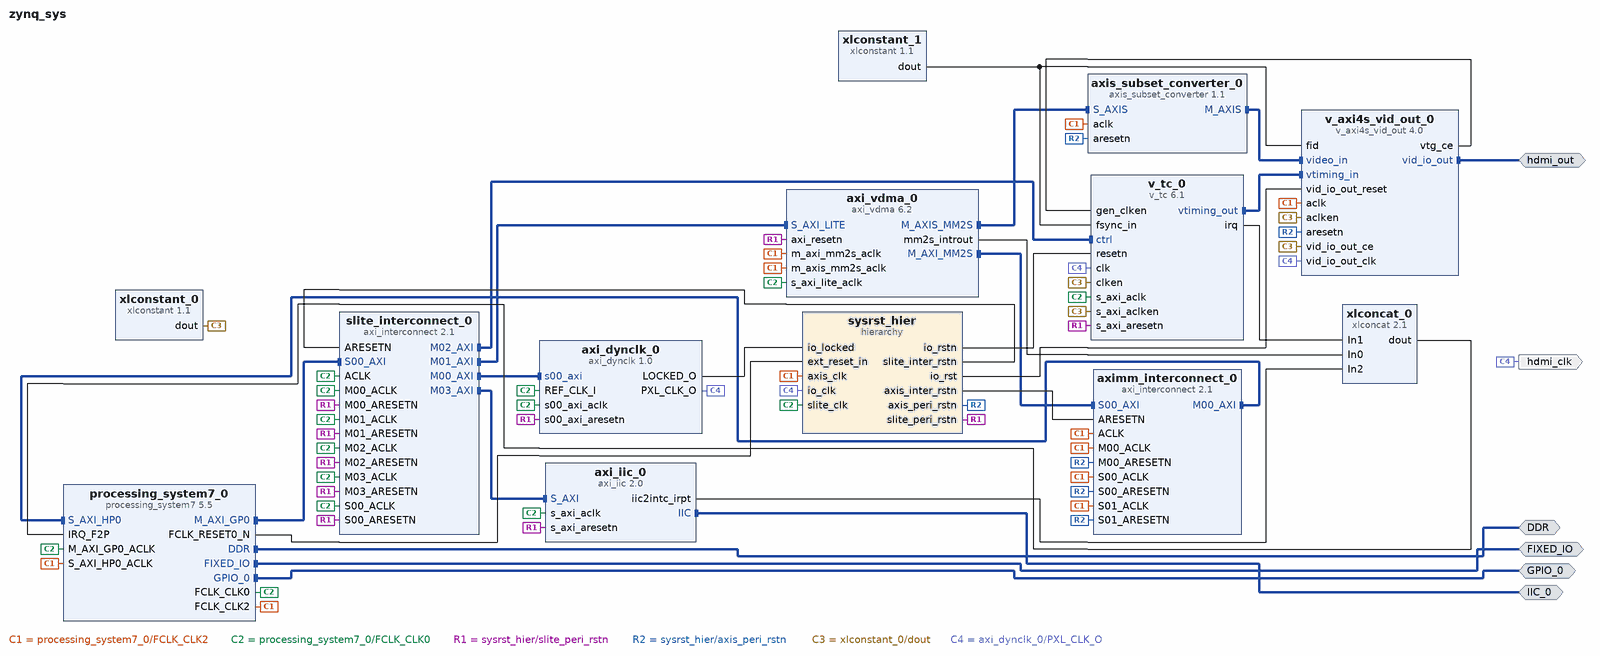
[diagram p0: block diagram of the top level]
# Vivado block design zynq_sys, Vivado 2015.4
create_bd_design zynq_sys

create_bd_intf_port -mode Master -vlnv xilinx.com:interface:vid_io_rtl:1.0 hdmi_out
create_bd_intf_port -mode Master -vlnv xilinx.com:interface:ddrx_rtl:1.0 DDR
create_bd_intf_port -mode Master -vlnv xilinx.com:display_processing_system7:fixedio_rtl:1.0 FIXED_IO
create_bd_intf_port -mode Master -vlnv xilinx.com:interface:gpio_rtl:1.0 GPIO_0
create_bd_intf_port -mode Master -vlnv xilinx.com:interface:iic_rtl:1.0 IIC_0
create_bd_port -dir O -type clk hdmi_clk

create_bd_cell -type ip -vlnv xilinx.com:ip:processing_system7:5.5 processing_system7_0
set_property -dict [list \
  CONFIG.PCW_FPGA0_PERIPHERAL_FREQMHZ 100 \
  CONFIG.PCW_FPGA1_PERIPHERAL_FREQMHZ 200 \
  CONFIG.PCW_FPGA2_PERIPHERAL_FREQMHZ 150 \
  CONFIG.PCW_USE_S_AXI_HP0 1 \
  CONFIG.PCW_USE_FABRIC_INTERRUPT 1 \
  CONFIG.PCW_EN_CLK1_PORT 1 \
  CONFIG.PCW_EN_CLK2_PORT 1 \
  CONFIG.PCW_IRQ_F2P_INTR 1 \
  CONFIG.PCW_PRESET_BANK1_VOLTAGE {LVCMOS 1.8V} \
  CONFIG.PCW_UIPARAM_DDR_PARTNO {MT41J256M16 RE-125} \
  CONFIG.PCW_QSPI_PERIPHERAL_ENABLE 1 \
  CONFIG.PCW_QSPI_QSPI_IO {MIO 1 .. 6} \
  CONFIG.PCW_QSPI_GRP_SINGLE_SS_ENABLE 1 \
  CONFIG.PCW_ENET0_PERIPHERAL_ENABLE 1 \
  CONFIG.PCW_ENET0_ENET0_IO {MIO 16 .. 27} \
  CONFIG.PCW_ENET0_GRP_MDIO_ENABLE 1 \
  CONFIG.PCW_ENET0_RESET_ENABLE 1 \
  CONFIG.PCW_ENET0_RESET_IO {MIO 51} \
  CONFIG.PCW_SD0_PERIPHERAL_ENABLE 1 \
  CONFIG.PCW_SD0_SD0_IO {MIO 40 .. 45} \
  CONFIG.PCW_UART0_PERIPHERAL_ENABLE 1 \
  CONFIG.PCW_UART0_UART0_IO {MIO 10 .. 11} \
  CONFIG.PCW_UART1_PERIPHERAL_ENABLE 1 \
  CONFIG.PCW_CAN0_PERIPHERAL_ENABLE 1 \
  CONFIG.PCW_CAN0_CAN0_IO {MIO 14 .. 15} \
  CONFIG.PCW_TTC0_PERIPHERAL_ENABLE 1 \
  CONFIG.PCW_USB0_PERIPHERAL_ENABLE 1 \
  CONFIG.PCW_USB0_RESET_ENABLE 0 \
  CONFIG.PCW_I2C1_PERIPHERAL_ENABLE 1 \
  CONFIG.PCW_I2C1_I2C1_IO {MIO 12 .. 13} \
  CONFIG.PCW_GPIO_MIO_GPIO_ENABLE 1 \
  CONFIG.PCW_GPIO_EMIO_GPIO_ENABLE 1 \
  CONFIG.PCW_FCLK2_PERIPHERAL_CLKSRC {ARM PLL} \
] [get_bd_cells processing_system7_0]
# 14 more settings of processing_system7_0 are not shown: defaults, MIO pin electricals, DDR timing, and values the tool derives
create_bd_cell -type ip -vlnv xilinx.com:ip:axi_vdma:6.2 axi_vdma_0
set_property -dict [list \
  CONFIG.c_num_fstores 1 \
  CONFIG.c_use_mm2s_fsync 0 \
  CONFIG.c_mm2s_genlock_mode 0 \
  CONFIG.c_include_s2mm 0 \
] [get_bd_cells axi_vdma_0]
create_bd_cell -type ip -vlnv xilinx.com:ip:v_axi4s_vid_out:4.0 v_axi4s_vid_out_0
set_property -dict {CONFIG.C_HAS_ASYNC_CLK 1 CONFIG.C_VTG_MASTER_SLAVE 1} [get_bd_cells v_axi4s_vid_out_0]
create_bd_cell -type ip -vlnv xilinx.com:ip:v_tc:6.1 v_tc_0
set_property -dict {CONFIG.VIDEO_MODE 1080p CONFIG.enable_detection false} [get_bd_cells v_tc_0]
create_bd_cell -type ip -vlnv xilinx.com:ip:axi_interconnect:2.1 slite_interconnect_0
set_property -dict {CONFIG.NUM_MI 4 CONFIG.STRATEGY 1} [get_bd_cells slite_interconnect_0]
create_bd_cell -type ip -vlnv xilinx.com:ip:axi_interconnect:2.1 aximm_interconnect_0
set_property -dict [list \
  CONFIG.NUM_SI 2 \
  CONFIG.NUM_MI 1 \
  CONFIG.STRATEGY 0 \
  CONFIG.ENABLE_ADVANCED_OPTIONS 0 \
  CONFIG.S00_HAS_DATA_FIFO 2 \
] [get_bd_cells aximm_interconnect_0]
create_bd_cell -type ip -vlnv xilinx.com:ip:xlconstant:1.1 xlconstant_0
create_bd_cell -type ip -vlnv xilinx.com:ip:axis_subset_converter:1.1 axis_subset_converter_0
set_property -dict [list \
  CONFIG.S_TDATA_NUM_BYTES 4 \
  CONFIG.M_TDATA_NUM_BYTES 2 \
  CONFIG.TDATA_REMAP {tdata[23:19],tdata[15:10],tdata[7:3]} \
  CONFIG.TUSER_REMAP {tuser[0:0]} \
  CONFIG.TKEEP_REMAP {tkeep[1:0]} \
] [get_bd_cells axis_subset_converter_0]
create_bd_cell -type hier sysrst_hier
create_bd_cell -type ip -vlnv xilinx.com:ip:xlconcat:2.1 xlconcat_0
set_property -dict {CONFIG.NUM_PORTS 3} [get_bd_cells xlconcat_0]
create_bd_cell -type ip -vlnv xilinx.com:ip:axi_iic:2.0 axi_iic_0
create_bd_cell -type ip -vlnv digilentinc.com:ip:axi_dynclk:1.0 axi_dynclk_0
create_bd_cell -type ip -vlnv xilinx.com:ip:xlconstant:1.1 xlconstant_1
set_property -dict {CONFIG.CONST_VAL 0} [get_bd_cells xlconstant_1]

# ---- hierarchy /sysrst_hier ----
current_bd_instance /sysrst_hier
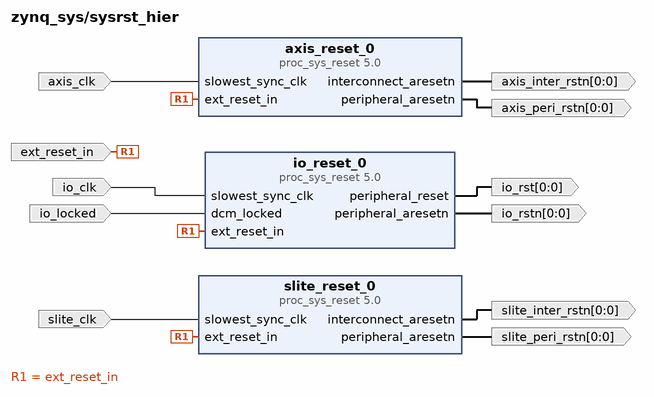
[diagram p1: block diagram inside /sysrst_hier]
create_bd_pin -dir I -type clk slite_clk
create_bd_pin -dir I -type rst ext_reset_in
create_bd_pin -dir O -from 0 -to 0 -type rst slite_inter_rstn
create_bd_pin -dir O -from 0 -to 0 -type rst slite_peri_rstn
create_bd_pin -dir I -type clk axis_clk
create_bd_pin -dir O -from 0 -to 0 -type rst axis_inter_rstn
create_bd_pin -dir O -from 0 -to 0 -type rst axis_peri_rstn
create_bd_pin -dir I -type clk io_clk
create_bd_pin -dir O -from 0 -to 0 -type rst io_rst
create_bd_pin -dir O -from 0 -to 0 -type rst io_rstn
create_bd_pin -dir I io_locked

create_bd_cell -type ip -vlnv xilinx.com:ip:proc_sys_reset:5.0 slite_reset_0
create_bd_cell -type ip -vlnv xilinx.com:ip:proc_sys_reset:5.0 axis_reset_0
create_bd_cell -type ip -vlnv xilinx.com:ip:proc_sys_reset:5.0 io_reset_0

# ---- connections ----

current_bd_instance /sysrst_hier
connect_bd_net -net processing_system7_0_FCLK_CLK0 [get_bd_pins slite_clk] [get_bd_pins slite_reset_0/slowest_sync_clk]
connect_bd_net -net processing_system7_0_FCLK_RESET0_N [get_bd_pins ext_reset_in] \
  [get_bd_pins axis_reset_0/ext_reset_in] [get_bd_pins slite_reset_0/ext_reset_in] [get_bd_pins io_reset_0/ext_reset_in]
connect_bd_net [get_bd_pins slite_reset_0/interconnect_aresetn] [get_bd_pins slite_inter_rstn]
connect_bd_net [get_bd_pins slite_reset_0/peripheral_aresetn] [get_bd_pins slite_peri_rstn]
connect_bd_net -net axi_clkgen_0_clk_0 [get_bd_pins axis_clk] [get_bd_pins axis_reset_0/slowest_sync_clk]
connect_bd_net [get_bd_pins axis_reset_0/interconnect_aresetn] [get_bd_pins axis_inter_rstn]
connect_bd_net [get_bd_pins axis_reset_0/peripheral_aresetn] [get_bd_pins axis_peri_rstn]
connect_bd_net -net slowest_sync_clk_1 [get_bd_pins io_clk] [get_bd_pins io_reset_0/slowest_sync_clk]
connect_bd_net [get_bd_pins io_reset_0/peripheral_reset] [get_bd_pins io_rst]
connect_bd_net [get_bd_pins io_reset_0/peripheral_aresetn] [get_bd_pins io_rstn]
connect_bd_net [get_bd_pins io_locked] [get_bd_pins io_reset_0/dcm_locked]

current_bd_instance /
connect_bd_intf_net [get_bd_intf_pins v_tc_0/vtiming_out] [get_bd_intf_pins v_axi4s_vid_out_0/vtiming_in]
connect_bd_intf_net [get_bd_intf_pins processing_system7_0/M_AXI_GP0] [get_bd_intf_pins slite_interconnect_0/S00_AXI]
connect_bd_intf_net -intf_net axi_interconnect_0_M01_AXI [get_bd_intf_pins slite_interconnect_0/M01_AXI] [get_bd_intf_pins axi_vdma_0/S_AXI_LITE]
connect_bd_intf_net [get_bd_intf_pins axi_vdma_0/M_AXI_MM2S] [get_bd_intf_pins aximm_interconnect_0/S00_AXI]
connect_bd_intf_net [get_bd_intf_pins aximm_interconnect_0/M00_AXI] [get_bd_intf_pins processing_system7_0/S_AXI_HP0]
connect_bd_intf_net [get_bd_intf_pins axis_subset_converter_0/S_AXIS] [get_bd_intf_pins axi_vdma_0/M_AXIS_MM2S]
connect_bd_intf_net [get_bd_intf_pins axi_dynclk_0/s00_axi] [get_bd_intf_pins slite_interconnect_0/M00_AXI]
connect_bd_intf_net [get_bd_intf_pins axis_subset_converter_0/M_AXIS] [get_bd_intf_pins v_axi4s_vid_out_0/video_in]
connect_bd_intf_net [get_bd_intf_pins v_tc_0/ctrl] [get_bd_intf_pins slite_interconnect_0/M02_AXI]
connect_bd_intf_net [get_bd_intf_pins axi_iic_0/S_AXI] [get_bd_intf_pins slite_interconnect_0/M03_AXI]
connect_bd_intf_net [get_bd_intf_ports hdmi_out] [get_bd_intf_pins v_axi4s_vid_out_0/vid_io_out]
connect_bd_intf_net [get_bd_intf_ports DDR] [get_bd_intf_pins processing_system7_0/DDR]
connect_bd_intf_net [get_bd_intf_ports FIXED_IO] [get_bd_intf_pins processing_system7_0/FIXED_IO]
connect_bd_intf_net [get_bd_intf_ports GPIO_0] [get_bd_intf_pins processing_system7_0/GPIO_0]
connect_bd_intf_net [get_bd_intf_ports IIC_0] [get_bd_intf_pins axi_iic_0/IIC]
connect_bd_net -net axi_clkgen_0_clk_0 [get_bd_pins processing_system7_0/FCLK_CLK2] \
  [get_bd_pins axi_vdma_0/m_axis_mm2s_aclk] [get_bd_pins processing_system7_0/S_AXI_HP0_ACLK] \
  [get_bd_pins axi_vdma_0/m_axi_mm2s_aclk] [get_bd_pins axis_subset_converter_0/aclk] [get_bd_pins v_axi4s_vid_out_0/aclk] \
  [get_bd_pins aximm_interconnect_0/ACLK] [get_bd_pins aximm_interconnect_0/S00_ACLK] \
  [get_bd_pins aximm_interconnect_0/M00_ACLK] [get_bd_pins sysrst_hier/axis_clk] [get_bd_pins aximm_interconnect_0/S01_ACLK]
connect_bd_net [get_bd_pins processing_system7_0/FCLK_CLK0] \
  [get_bd_pins axi_vdma_0/s_axi_lite_aclk] [get_bd_pins processing_system7_0/M_AXI_GP0_ACLK] [get_bd_pins v_tc_0/s_axi_aclk] \
  [get_bd_pins axi_iic_0/s_axi_aclk] [get_bd_pins axi_dynclk_0/s00_axi_aclk] [get_bd_pins axi_dynclk_0/REF_CLK_I] \
  [get_bd_pins slite_interconnect_0/M01_ACLK] [get_bd_pins slite_interconnect_0/ACLK] \
  [get_bd_pins slite_interconnect_0/S00_ACLK] [get_bd_pins slite_interconnect_0/M00_ACLK] \
  [get_bd_pins slite_interconnect_0/M02_ACLK] [get_bd_pins slite_interconnect_0/M03_ACLK] [get_bd_pins sysrst_hier/slite_clk]
connect_bd_net [get_bd_pins processing_system7_0/FCLK_RESET0_N] [get_bd_pins sysrst_hier/ext_reset_in]
connect_bd_net -net slite_reset_0_interconnect_aresetn [get_bd_pins sysrst_hier/slite_inter_rstn] [get_bd_pins slite_interconnect_0/ARESETN]
connect_bd_net -net slite_reset_0_peripheral_aresetn [get_bd_pins sysrst_hier/slite_peri_rstn] \
  [get_bd_pins v_tc_0/s_axi_aresetn] [get_bd_pins axi_vdma_0/axi_resetn] [get_bd_pins axi_iic_0/s_axi_aresetn] \
  [get_bd_pins axi_dynclk_0/s00_axi_aresetn] [get_bd_pins slite_interconnect_0/S00_ARESETN] \
  [get_bd_pins slite_interconnect_0/M00_ARESETN] [get_bd_pins slite_interconnect_0/M01_ARESETN] \
  [get_bd_pins slite_interconnect_0/M02_ARESETN] [get_bd_pins slite_interconnect_0/M03_ARESETN]
connect_bd_net -net axis_reset_0_interconnect_aresetn [get_bd_pins sysrst_hier/axis_inter_rstn] [get_bd_pins aximm_interconnect_0/ARESETN]
connect_bd_net -net axis_reset_0_peripheral_aresetn [get_bd_pins sysrst_hier/axis_peri_rstn] \
  [get_bd_pins axis_subset_converter_0/aresetn] [get_bd_pins v_axi4s_vid_out_0/aresetn] \
  [get_bd_pins aximm_interconnect_0/S00_ARESETN] [get_bd_pins aximm_interconnect_0/M00_ARESETN] \
  [get_bd_pins aximm_interconnect_0/S01_ARESETN]
connect_bd_net [get_bd_pins xlconstant_0/dout] \
  [get_bd_pins v_axi4s_vid_out_0/aclken] [get_bd_pins v_axi4s_vid_out_0/vid_io_out_ce] [get_bd_pins v_tc_0/clken] \
  [get_bd_pins v_tc_0/s_axi_aclken]
connect_bd_net [get_bd_pins xlconcat_0/dout] [get_bd_pins processing_system7_0/IRQ_F2P]
connect_bd_net [get_bd_pins axi_vdma_0/mm2s_introut] [get_bd_pins xlconcat_0/In0]
connect_bd_net [get_bd_pins v_tc_0/irq] [get_bd_pins xlconcat_0/In1]
connect_bd_net -net axi_clkgen_0_clk_1 [get_bd_pins axi_dynclk_0/PXL_CLK_O] \
  [get_bd_ports hdmi_clk] [get_bd_pins v_axi4s_vid_out_0/vid_io_out_clk] [get_bd_pins v_tc_0/clk] \
  [get_bd_pins sysrst_hier/io_clk]
connect_bd_net -net sysrst_hier_io_rstn [get_bd_pins sysrst_hier/io_rst] [get_bd_pins v_axi4s_vid_out_0/vid_io_out_reset]
connect_bd_net [get_bd_pins sysrst_hier/io_rstn] [get_bd_pins v_tc_0/resetn]
connect_bd_net [get_bd_pins axi_iic_0/iic2intc_irpt] [get_bd_pins xlconcat_0/In2]
connect_bd_net [get_bd_pins axi_dynclk_0/LOCKED_O] [get_bd_pins sysrst_hier/io_locked]
connect_bd_net [get_bd_pins v_axi4s_vid_out_0/vtg_ce] [get_bd_pins v_tc_0/gen_clken]
connect_bd_net [get_bd_pins xlconstant_1/dout] [get_bd_pins v_tc_0/fsync_in] [get_bd_pins v_axi4s_vid_out_0/fid]

# ---- address map ----
assign_bd_address -offset 0x00000000 -range 1G -target_address_space [get_bd_addr_spaces axi_vdma_0/Data_MM2S] [get_bd_addr_segs processing_system7_0/S_AXI_HP0/HP0_DDR_LOWOCM]
assign_bd_address -offset 0x43000000 -range 64K -target_address_space [get_bd_addr_spaces processing_system7_0/Data] [get_bd_addr_segs axi_vdma_0/S_AXI_LITE/Reg]
assign_bd_address -offset 0x43C30000 -range 64K -target_address_space [get_bd_addr_spaces processing_system7_0/Data] [get_bd_addr_segs v_tc_0/ctrl/Reg]
assign_bd_address -offset 0x43C40000 -range 64K -target_address_space [get_bd_addr_spaces processing_system7_0/Data] [get_bd_addr_segs axi_iic_0/S_AXI/Reg]
assign_bd_address -offset 0x43C50000 -range 64K -target_address_space [get_bd_addr_spaces processing_system7_0/Data] [get_bd_addr_segs axi_dynclk_0/s00_axi/reg0]

validate_bd_design
save_bd_design
